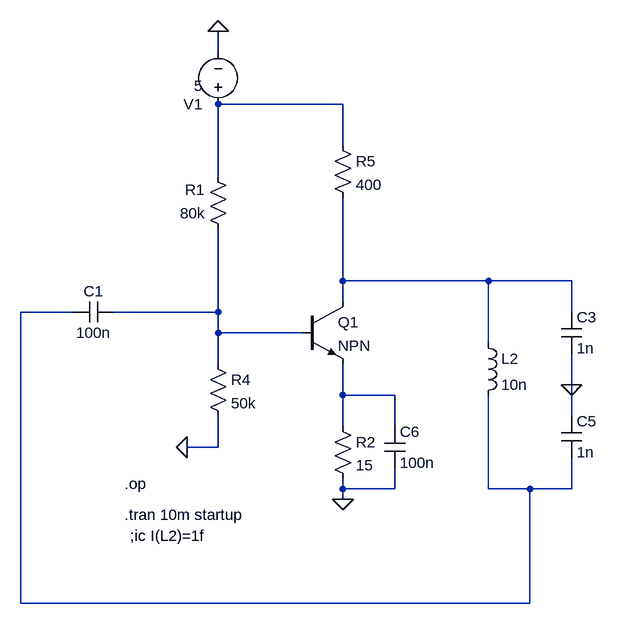
[diagram p0: schematic osc-colpin.asc]
osc-colpin.asc, the LTspice schematic file:
Version 4
SHEET 1 988 680
WIRE 0 -304 0 -336
WIRE 192 -224 0 -224
WIRE 192 -160 192 -224
WIRE 0 -112 0 -224
WIRE 192 48 192 -80
WIRE 416 48 192 48
WIRE 544 48 416 48
WIRE 192 80 192 48
WIRE -224 96 -304 96
WIRE 0 96 0 -32
WIRE 0 96 -160 96
WIRE 544 96 544 48
WIRE 0 128 0 96
WIRE 128 128 0 128
WIRE 416 144 416 48
WIRE 0 176 0 128
WIRE 544 208 544 160
WIRE 192 224 192 176
WIRE 272 224 192 224
WIRE 544 256 544 208
WIRE 192 272 192 224
WIRE 272 272 272 224
WIRE 0 304 0 256
WIRE 0 304 -48 304
WIRE 192 368 192 352
WIRE 272 368 272 336
WIRE 272 368 192 368
WIRE 416 368 416 224
WIRE 480 368 416 368
WIRE 544 368 544 320
WIRE 544 368 480 368
WIRE 192 384 192 368
WIRE -304 544 -304 96
WIRE 480 544 480 368
WIRE 480 544 -304 544
FLAG 0 -336 0
FLAG 192 384 0
FLAG -48 304 0
FLAG 544 208 0
DATAFLAG 592 464 ""
DATAFLAG 192 224 ""
DATAFLAG 80 128 ""
SYMBOL res 16 -16 R180
WINDOW 0 36 76 Left 2
WINDOW 3 36 40 Left 2
SYMATTR InstName R1
SYMATTR Value 80k
SYMBOL voltage 0 -208 R180
WINDOW 3 24 44 Left 2
WINDOW 123 0 0 Left 0
WINDOW 39 0 0 Left 0
SYMATTR Value 5
SYMATTR InstName V1
SYMBOL res -16 160 R0
SYMATTR InstName R4
SYMATTR Value 50k
SYMBOL cap 528 96 R0
SYMATTR InstName C3
SYMATTR Value 1n
SYMBOL cap 528 256 R0
SYMATTR InstName C5
SYMATTR Value 1n
SYMBOL ind 400 128 R0
SYMATTR InstName L2
SYMATTR Value 10n
SYMBOL res 176 256 R0
SYMATTR InstName R2
SYMATTR Value 15
SYMBOL cap 256 272 R0
SYMATTR InstName C6
SYMATTR Value 100n
SYMBOL res 176 -176 R0
SYMATTR InstName R5
SYMATTR Value 400
SYMBOL cap -160 80 R90
WINDOW 0 0 32 VBottom 2
WINDOW 3 32 32 VTop 2
SYMATTR InstName C1
SYMATTR Value 100n
SYMBOL npn 128 80 R0
SYMATTR InstName Q1
TEXT -144 360 Left 2 !.op
TEXT -144 408 Left 2 !.tran 10m startup
TEXT -136 440 Left 2 !;ic I(L2)=1f

The netlist it stands for:
* osc-colpin.asc
R1 N004 N001 80k
V1 N001 0 5
R4 N004 0 50k
C3 N002 0 1n
C5 0 N003 1n
L2 N002 N003 10n
R2 N005 0 15
C6 N005 0 100n
R5 N001 N002 400
C1 N004 N003 100n
Q1 N002 N004 N005 0 NPN
.model NPN NPN
.model PNP PNP
.lib standard.bjt
.op
.tran 10m startup
;ic I(L2)=1f
.backanno
.end